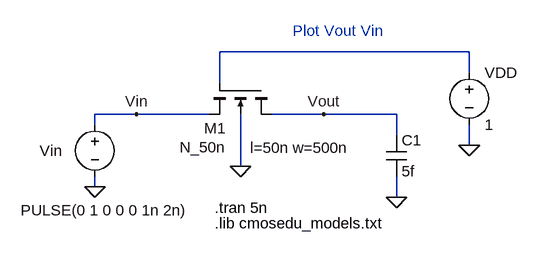
[diagram p0: schematic Fig10_14.asc]
Fig10_14.asc, the LTspice schematic file:
Version 4
SHEET 1 1136 680
WIRE 208 -96 208 -112
WIRE 208 0 208 -16
WIRE 272 -112 208 -112
WIRE 384 -112 272 -112
WIRE 400 -160 400 -208
WIRE 432 -32 432 -112
WIRE 560 -112 480 -112
WIRE 672 -112 560 -112
WIRE 672 -80 672 -112
WIRE 672 16 672 -16
WIRE 784 -208 400 -208
WIRE 784 -176 784 -208
WIRE 784 -64 784 -96
FLAG 208 0 0
FLAG 672 16 0
FLAG 560 -112 Vout
FLAG 272 -112 Vin
FLAG 432 -32 0
FLAG 784 -64 0
SYMBOL nmos4 480 -160 R90
WINDOW 0 70 70 VRight 0
WINDOW 3 99 70 VRight 0
WINDOW 123 100 -119 VRight 0
SYMATTR InstName M1
SYMATTR Value N_50n
SYMATTR Value2 l=50n w=500n
SYMBOL voltage 208 -112 R0
WINDOW 0 -85 56 Left 0
WINDOW 3 -114 148 Left 0
WINDOW 123 0 0 Left 0
WINDOW 39 0 0 Left 0
SYMATTR InstName Vin
SYMATTR Value PULSE(0 1 0 0 0 1n 2n)
SYMBOL cap 656 -80 R0
SYMATTR InstName C1
SYMATTR Value 5f
SYMBOL voltage 784 -192 R0
WINDOW 123 0 0 Left 0
WINDOW 39 0 0 Left 0
SYMATTR InstName VDD
SYMATTR Value 1
TEXT 392 32 Left 0 !.tran 5n
TEXT 392 56 Left 0 !.lib cmosedu_models.txt
TEXT 512 -240 Left 0 ;Plot Vout Vin

The netlist it stands for:
* Fig10_14.asc
M1 Vout N001 Vin 0 N_50n l=50n w=500n
Vin Vin 0 PULSE(0 1 0 0 0 1n 2n)
C1 Vout 0 5f
VDD N001 0 1
.model NMOS NMOS
.model PMOS PMOS
.lib standard.mos
.tran 5n
.lib cmosedu_models.txt
* Plot Vout Vin
.backanno
.end